# Altium project 电池架负极均衡板.PrjPcb
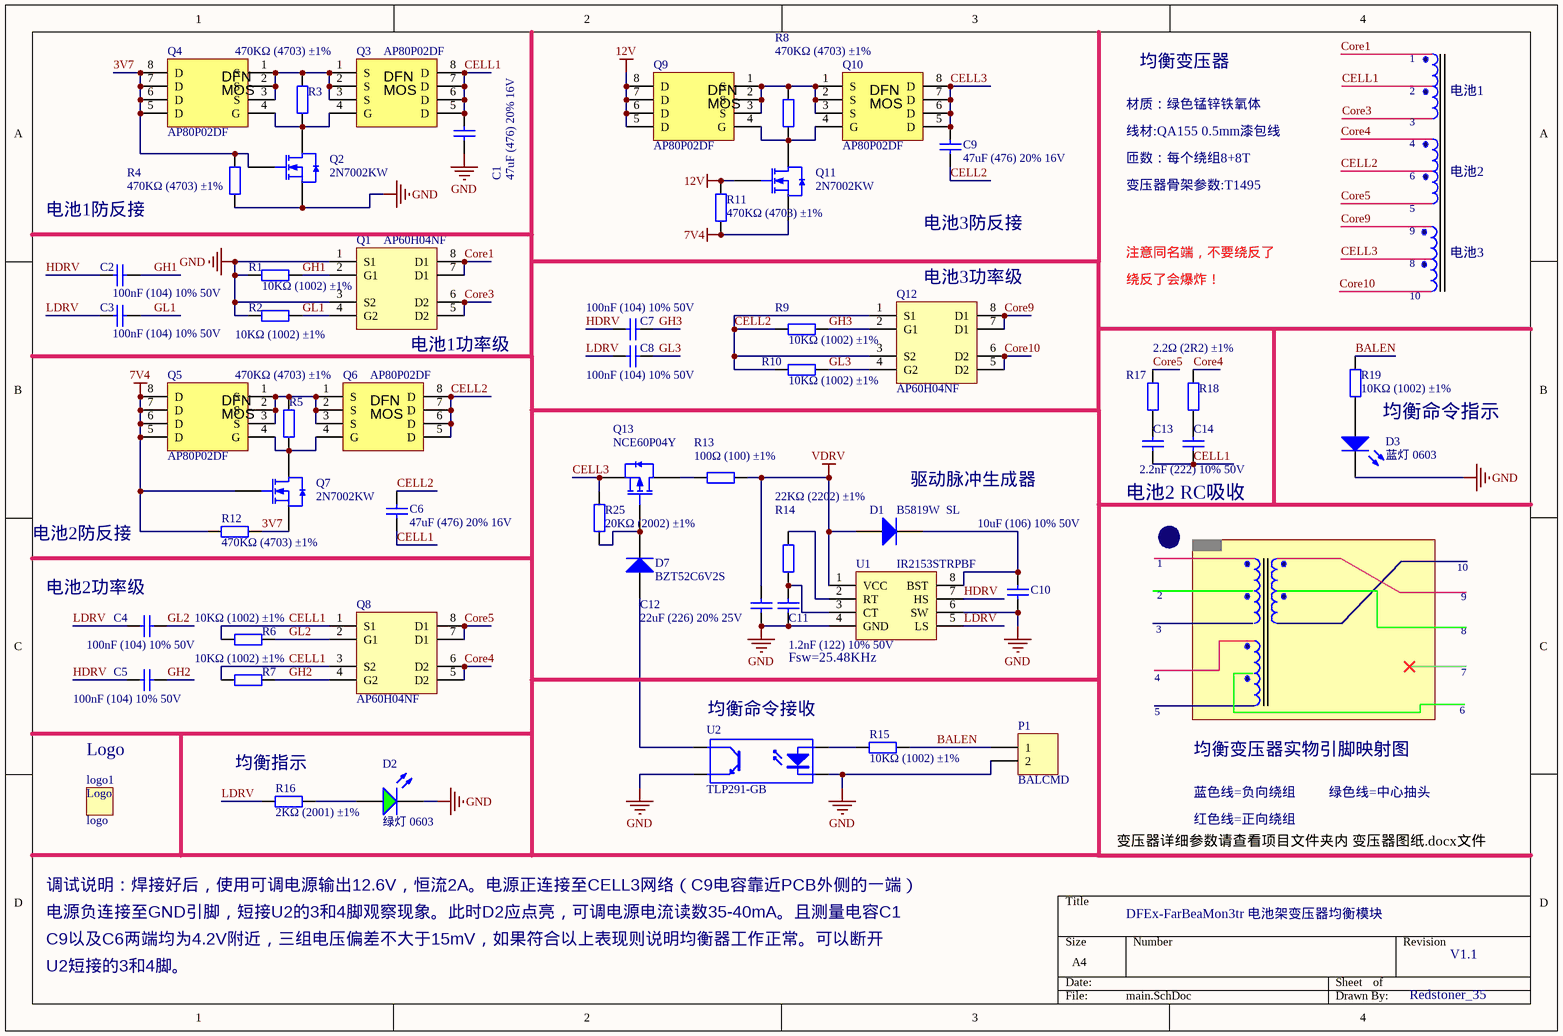
[diagram p0: main.SchDoc]
1 sheet, 55 parts. Net scope: global (net labels, ports and power ports of the same name join across sheets).
Board file: PCB3.PcbDoc

## Sheet main.SchDoc
size A4

### Parts
C1  47uF (476) 20% 16V  [1206_C]
C2  100nF (104) 10% 50V  [1206_C]
C3  100nF (104) 10% 50V  [1206_C]
C4  100nF (104) 10% 50V  [1206_C]
C5  100nF (104) 10% 50V  [1206_C]
C6  47uF (476) 20% 16V  [1206_C]
C7  100nF (104) 10% 50V  [1206_C]
C8  100nF (104) 10% 50V  [1206_C]
C9  47uF (476) 20% 16V  [1206_C]
C10  10uF (106) 10% 50V  [1206_C]
C11  1.2nF (122) 10% 50V  [0402_C]
C12  22uF (226) 20% 25V  [0805_C]
C13  2.2nF (222) 10% 50V  [0402_C]
C14  2.2nF (222) 10% 50V  [0402_C]  (value not drawn)
D1  B5819W  SL  [SOD-123]
D2  绿灯 0603  [0603_LED_S1]
D3  蓝灯 0603  [0603_LED_S1]
D7  BZT52C6V2S  [SOD-323]
logo1  logo  [HIGH-VOLTAGE-2]
P1  BALCMD  [PH2.0-WS-2P]
Q1  AP60H04NF  [Dual SSO8]
Q2  2N7002KW  [SC70-3]
Q3  AP80P02DF  [DFN-8_L3.0-W3.0-P0.65-BL]
Q4  AP80P02DF  [DFN-8_L3.0-W3.0-P0.65-BL]
Q5  AP80P02DF  [DFN-8_L3.0-W3.0-P0.65-BL]
Q6  AP80P02DF  [DFN-8_L3.0-W3.0-P0.65-BL]
Q7  2N7002KW  [SC70-3]
Q8  AP60H04NF  [Dual SSO8]
Q9  AP80P02DF  [DFN-8_L3.0-W3.0-P0.65-BL]
Q10  AP80P02DF  [DFN-8_L3.0-W3.0-P0.65-BL]
Q11  2N7002KW  [SC70-3]
Q12  AP60H04NF  [Dual SSO8]
Q13  NCE60P04Y  [SOT-23(SOT-23-3)]
R1  10KΩ (1002) ±1%  [0402_R]
R2  10KΩ (1002) ±1%  [0402_R]
R3  470KΩ (4703) ±1%  [0402_R]
R4  470KΩ (4703) ±1%  [0402_R]
R5  470KΩ (4703) ±1%  [0402_R]
R6  10KΩ (1002) ±1%  [0402_R]
R7  10KΩ (1002) ±1%  [0402_R]
R8  470KΩ (4703) ±1%  [0402_R]
R9  10KΩ (1002) ±1%  [0402_R]
R10  10KΩ (1002) ±1%  [0402_R]
R11  470KΩ (4703) ±1%  [0402_R]
R12  470KΩ (4703) ±1%  [0402_R]
R13  100Ω (100) ±1%  [1206_R]
R14  22KΩ (2202) ±1%  [0402_R]
R15  10KΩ (1002) ±1%  [0402_R]
R16  2KΩ (2001) ±1%  [0402_R]
R17  2.2Ω (2R2) ±1%  [0402_R]
R18  2.2Ω (2R2) ±1%  [0402_R]  (value not drawn)
R19  10KΩ (1002) ±1%  [0402_R]
R25  20KΩ (2002) ±1%  [0402_R]
U1  IR2153STRPBF  [SO8_N]
U2  TLP291-GB  [SOP127P700X210-4M]

### Nets
7V4: Q5.5(D) Q5.6(D) Q5.7(D) Q5.8(D) Q7.1(G) Q11.2(S) R11.1 R12.2
12V: Q9.5(D) Q9.6(D) Q9.7(D) Q9.8(D) Q11.1(G) R11.2
GND: C1.1 C10.1 C11.1 C12.1 D2.K D3.K P1.2 Q1.1(S1) Q1.3(S2) Q2.2(S) R1.1 R2.1 R4.1 U1.4(GND) U1.6(SW) U2.2(K) U2.3(E)
VDRV: C12.2 D1.1(A) R13.2 U1.1(VCC)
3V7: Q2.1(G) Q4.5(D) Q4.6(D) Q4.7(D) Q4.8(D) Q7.2(S) R4.2 R12.1
BALEN: P1.1 R15.2 R19.2
CELL1: C1.2 C6.1 C13.1 C14.1 Q3.5(D) Q3.6(D) Q3.7(D) Q3.8(D) Q8.1(S1) Q8.3(S2) R6.1 R7.1
CELL2: C6.2 C9.1 Q6.5(D) Q6.6(D) Q6.7(D) Q6.8(D) Q12.1(S1) Q12.3(S2) R9.1 R10.1
CELL3: C9.2 Q10.5(D) Q10.6(D) Q10.7(D) Q10.8(D) Q13.2(S) R25.2
Core1: Q1.7(D1) Q1.8(D1)
Core3: Q1.5(D2) Q1.6(D2)
Core4: Q8.5(D2) Q8.6(D2) R18.2
Core5: Q8.7(D1) Q8.8(D1) R17.2
Core9: Q12.7(D1) Q12.8(D1)
Core10: Q12.5(D2) Q12.6(D2)
GH1: C2.2 Q1.2(G1) R1.2
GH2: C5.2 Q8.4(G2) R7.2
GH3: C7.2 Q12.2(G1) R9.2
GL1: C3.2 Q1.4(G2) R2.2
GL2: C4.2 Q8.2(G1) R6.2
GL3: C8.2 Q12.4(G2) R10.2
HDRV: C2.1 C5.1 C7.1 U1.7(HS)
LDRV: C3.1 C4.1 C8.1 R16.1 U1.5(LS)
NetC10_2: C10.2 D1.2(K) U1.8(BST)
NetC11_2: C11.2 R14.1 U1.3(CT)
NetC13_2: C13.2 R17.1
NetC14_2: C14.2 R18.1
NetD2_A: D2.A R16.2
NetD3_A: D3.A R19.1
NetD7_1: D7.1(A) U2.4(C)
NetD7_2: D7.2(K) Q13.1(G) R25.1
NetQ2_3: Q2.3(D) Q3.4(G) Q4.4(G) R3.1
NetQ3_1: Q3.1(S) Q3.2(S) Q3.3(S) Q4.1(S) Q4.2(S) Q4.3(S) R3.2
NetQ5_1: Q5.1(S) Q5.2(S) Q5.3(S) Q6.1(S) Q6.2(S) Q6.3(S) R5.2
NetQ5_4: Q5.4(G) Q6.4(G) Q7.3(D) R5.1
NetQ9_1: Q9.1(S) Q9.2(S) Q9.3(S) Q10.1(S) Q10.2(S) Q10.3(S) R8.2
NetQ9_4: Q9.4(G) Q10.4(G) Q11.3(D) R8.1
NetQ13_3: Q13.3(D) R13.1
NetR14_2: R14.2 U1.2(RT)
NetR15_1: R15.1 U2.1(A)

### Notes on the sheet
- 材质：绿色锰锌铁氧体
- 均衡变压器
- 1
- 2
- 电池1
- 线材:QA155 0.5mm漆包线
- 匝数：每个绕组8+8T
- 3
- 4
- 6
- 电池2
- 电池1防反接
- 电池3防反接
- 变压器骨架参数:T1495
- 5
- 9
- (near Q12) 电池3功率级
- 注意同名端，不要绕反了
- 绕反了会爆炸！
- 8
- 10
- 电池3
- (near Q1) 电池1功率级
- 均衡命令指示
- (near D1) 驱动脉冲生成器
- 电池2 RC吸收
- 电池2防反接
- (near C4) 电池2功率级
- (near U2) 均衡命令接收
- Fsw=25.48KHz
- 7
- Logo
- (near R16) 均衡指示
- 均衡变压器实物引脚映射图
- 变压器详细参数请查看项目文件夹内 变压器图纸.docx文件
- 蓝色线=负向绕组
- 红色线=正向绕组
- 绿色线=中心抽头
- 调试说明：焊接好后，使用可调电源输出12.6V，恒流2A。电源正连接至CELL3网络（C9电容靠近PCB外侧的一端）
- 电源负连接至GND引脚，短接U2的3和4脚观察现象。此时D2应点亮，可调电源电流读数35-40mA。且测量电容C1
- DFEx-FarBeaMon3tr 电池架变压器均衡模块
- C9以及C6两端均为4.2V附近，三组电压偏差不大于15mV，如果符合以上表现则说明均衡器工作正常。可以断开
- U2短接的3和4脚。
- V1.1
- Redstoner_35
- Labels drawn without touching a wire or pin: CELL1, CELL2, CELL3, Core1, Core3, Core4, Core5, Core9, Core10
- (in symbol logo) Logo
- (in symbol SON/DFN5x6 MOS) DFN; MOS

### Library data of the parts
C1 C6 C9 = 1206 220pF (221) 10% 50V: 贴片电容; ComponentLink1Description: 供应商链接; ComponentLink1URL: http://www.szlcsc.com/product/details_2206.html; Package: 1206; Supplier: LC; SuppliersPartNumber: C1854
C2-C5 C7 C8 = 1206 100nF (104) 10% 50V: 贴片电容; ComponentLink1Description: 供应商链接; ComponentLink1URL: http://www.szlcsc.com/product/details_25237.html; Package: 1206; Supplier: LC; SuppliersPartNumber: C24497
C10 = 1206 10uF (106) 10% 50V: 贴片电容; ComponentLink1Description: 供应商链接; ComponentLink1URL: http://www.szlcsc.com/product/details_14236.html; Package: 1206; Supplier: LC; SuppliersPartNumber: C13585
C11 = 0402 1nF (102) 10% 50V: 贴片电容; ComponentLink1Description: 供应商链接; ComponentLink1URL: http://www.szlcsc.com/product/details_1875.html; Package: 0402; Supplier: LC; SuppliersPartNumber: C1523
C12 = 0805 22uF (226) 20% 25V: 贴片电容; ComponentLink1Description: 供应商链接; ComponentLink1URL: http://www.szlcsc.com/product/details_46786.html; Package: 0805; Supplier: LC; SuppliersPartNumber: C45783
C13 C14 = 0402 2.2nF (222) 10% 50V: 贴片电容; ComponentLink1Description: 供应商链接; ComponentLink1URL: http://www.szlcsc.com/product/details_1883.html; Package: 0402; Supplier: LC; SuppliersPartNumber: C1531
D1 = SOD-123 B5819W  SL: 肖特基二极管; ComponentLink1Description: 供应商链接; ComponentLink1URL: http://www.szlcsc.com/product/details_9093.html; Package: SOD-123; Supplier: LC; SuppliersPartNumber: C8598
D2 = 0603 绿灯: 发光二极管; ComponentLink1Description: 供应商链接; ComponentLink1URL: http://www.szlcsc.com/product/details_73152.html; Package: 0603; Supplier: LC; SuppliersPartNumber: C72043
D3 = 0603 蓝灯: 发光二极管; ComponentLink1Description: 供应商链接; ComponentLink1URL: http://www.szlcsc.com/product/details_73150.html; Package: 0603; Supplier: LC; SuppliersPartNumber: C72041
D7 = SOD-323 1N4148WS T4: SOD-323稳压二极管 6.2V稳压电压; ComponentLink1Description: 供应商链接; ComponentLink1URL: http://www.szlcsc.com/product/details_2485.html; Package: SOD-323; Supplier: LC; SuppliersPartNumber: C2128
P1 = CON 2: 2-Pin; LatestRevisionDate: 17-Jul-2002; LatestRevisionNote: Re-released for DXP Platform.; Publisher: Altium Limited
Q1 Q8 Q12 = AP60H04NF: APM双N沟道MOS管，DFN56封装，40V/60A 4.8mΩ/4.5V Vgs
Q2 Q7 Q11 = 2N7002 7002: 单N沟道MOSFET(场效应管); ComponentLink1Description: 供应商链接; ComponentLink1URL: http://www.szlcsc.com/product/details_9040.html; Package: SOT-323; Supplier: LC; SuppliersPartNumber: C???????
Q3-Q6 Q9 Q10 = SON/DFN5x6 MOS: PDFN3x3 20V 50A 5.8mΩ N-Ch MOSFET
Q13 = SI2301CDS-T1-GE3: MOS(场效应管); ComponentLink1Description: 供应商链接; ComponentLink1URL: http://www.szlcsc.com/product/details_11030.html; Package: SOT-23(SOT-23-3); Supplier: LC; SuppliersPartNumber: C10487
R1 R2 R6 R7 R9 R10 R15 R19 = 0402 10KΩ (1002) 1%: 贴片电阻; ComponentLink1Description: 供应商链接; ComponentLink1URL: http://www.szlcsc.com/product/details_26487.html; Package: 0402; Supplier: LC; SuppliersPartNumber: C25744
R3-R5 R8 R11 R12 = 0402 470KΩ (4703) 1%: 贴片电阻; ComponentLink1Description: 供应商链接; ComponentLink1URL: http://www.szlcsc.com/product/details_26533.html; Package: 0402; Supplier: LC; SuppliersPartNumber: C25790
R13 = 1206 4.7KΩ (4701) 1%: 贴片电阻; ComponentLink1Description: 供应商链接; ComponentLink1URL: http://www.szlcsc.com/product/details_18624.html; Package: 1206; Supplier: LC; SuppliersPartNumber: C17936
R14 = 0402 39KΩ (3902) 1%: 贴片电阻; ComponentLink1Description: 供应商链接; ComponentLink1URL: http://www.szlcsc.com/product/details_26526.html; Package: 0402; Supplier: LC; SuppliersPartNumber: C25783
R16 = 0402 2KΩ (2001) 1%: 贴片电阻; ComponentLink1Description: 供应商链接; ComponentLink1URL: http://www.szlcsc.com/product/details_4516.html; Package: 0402; Supplier: LC; SuppliersPartNumber: C4109
R17 R18 = 0402 1Ω (1R00) 1%: 贴片电阻; ComponentLink1Description: 供应商链接; ComponentLink1URL: http://www.szlcsc.com/product/details_25829.html; Package: 0402; Supplier: LC; SuppliersPartNumber: C25086
R25 = 0402 20KΩ (2002) 1%: 贴片电阻; ComponentLink1Description: 供应商链接; ComponentLink1URL: http://www.szlcsc.com/product/details_26508.html; Package: 0402; Supplier: LC; SuppliersPartNumber: C25765
U1 = EG2153: 600V耐压，自震荡具备死区时间的2A峰值驱动能力半桥驱动芯片
U2 = Optoisolator1: 4-Pin Phototransistor Optocoupler; Published: 24-Mar-1999; LatestRevisionDate: 04-Mar-2005; LatestRevisionNote: Sch pins 3 & 4 Swapped.; DatasheetVersion: Nov-2003; PackageReference: DIP-4; Publisher: Altium Limited